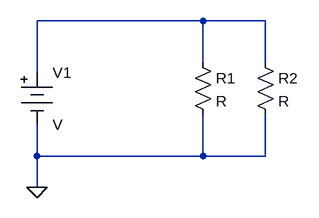
[diagram p0: schematic Draft7.asc]
Draft7.asc, the LTspice schematic file:
Version 4
SHEET 1 880 680
WIRE 336 0 80 0
WIRE 432 0 336 0
WIRE 336 64 336 0
WIRE 432 64 432 0
WIRE 80 80 80 0
WIRE 80 208 80 160
WIRE 336 208 336 144
WIRE 336 208 80 208
WIRE 432 208 432 144
WIRE 432 208 336 208
WIRE 80 256 80 208
FLAG 80 256 0
SYMBOL Misc\\battery 80 64 R0
SYMATTR InstName V1
SYMBOL res 320 48 R0
SYMATTR InstName R1
SYMBOL res 416 48 R0
SYMATTR InstName R2

The netlist it stands for:
* Draft7.asc
V1 N001 0 V
R1 N001 0 R
R2 N001 0 R
.backanno
.end